# EAGLE design cat (EAGLE 9.3.1)
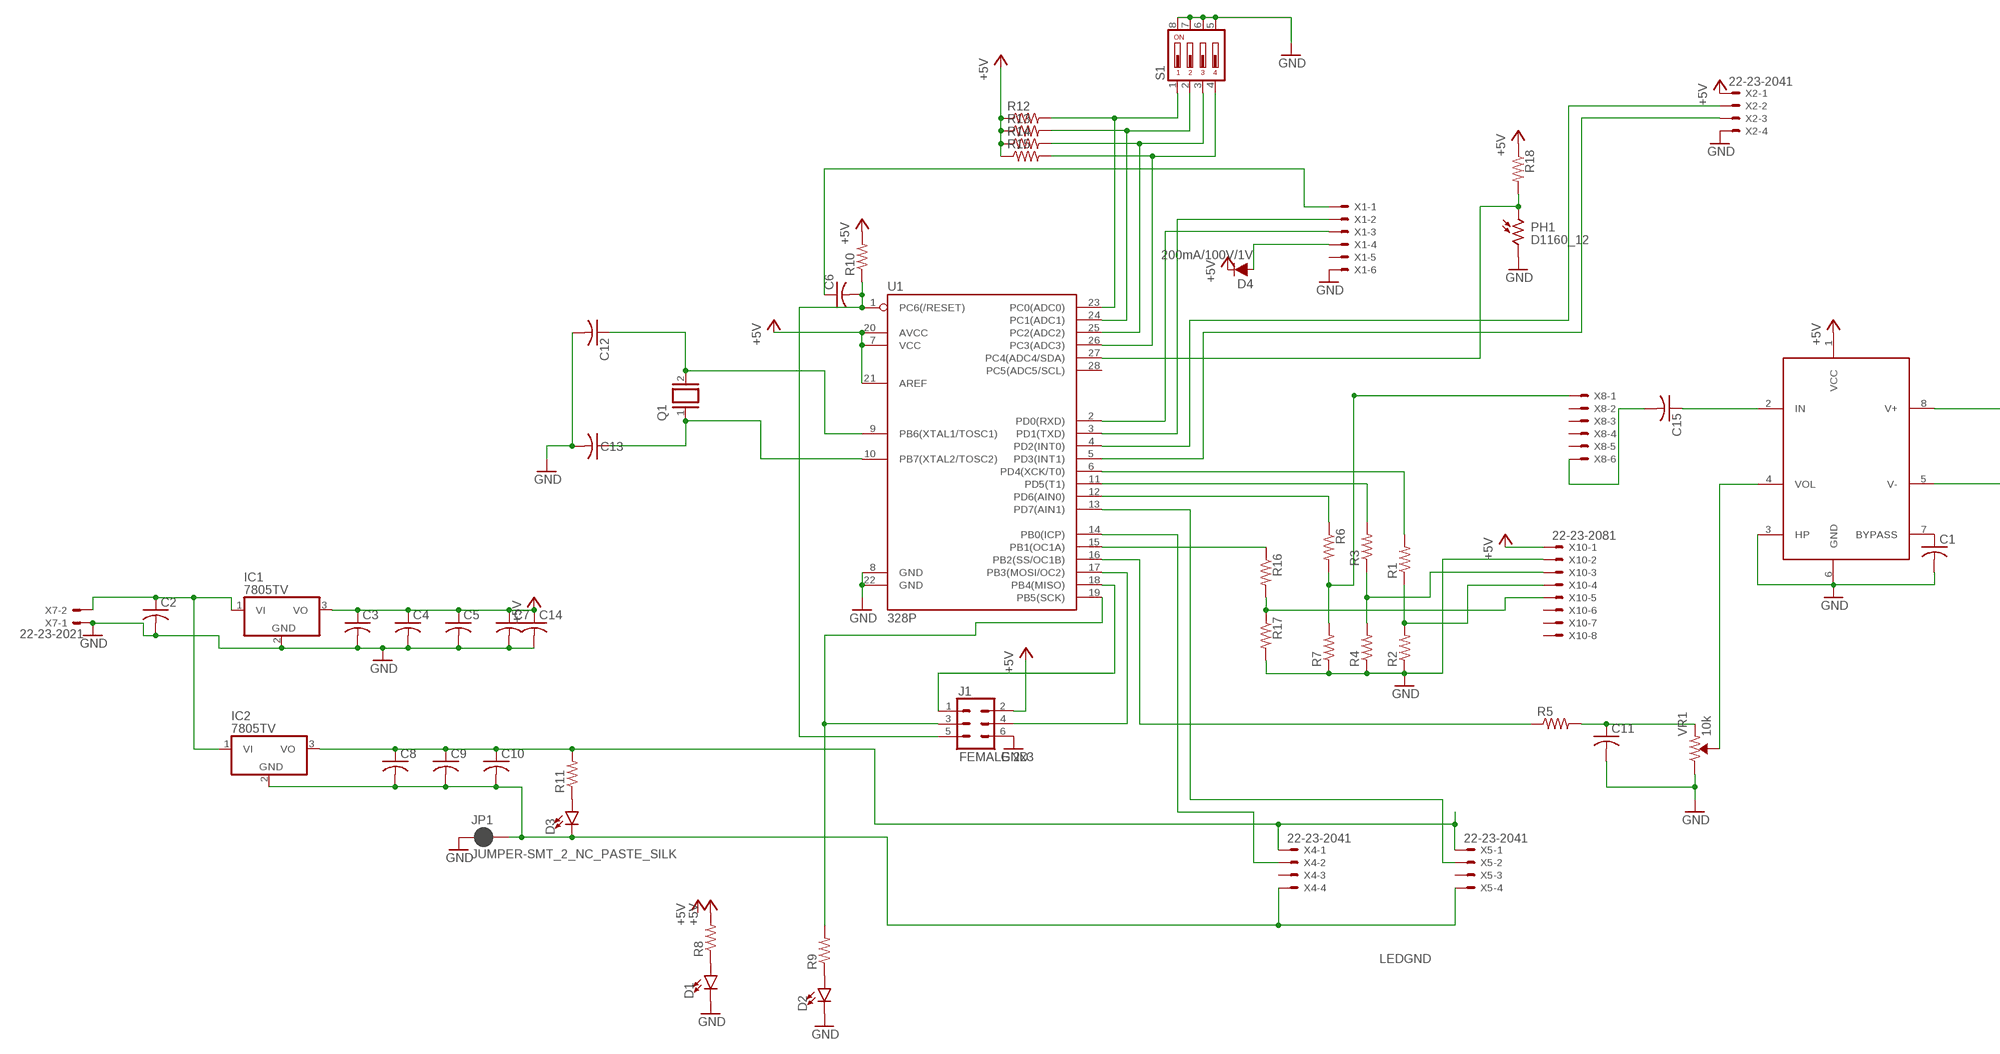
[diagram p0: schematic, sheet 1, part 1 of 2]
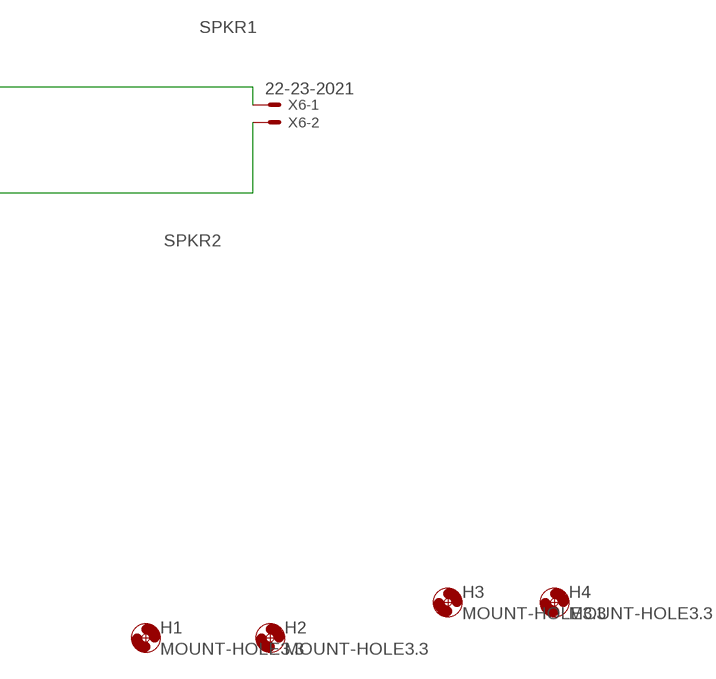
[diagram p1: schematic, sheet 1, part 2 of 2]

## Parts
C1  C-US025-024X044  [C025-024X044]
C2  C-US025-024X044  [C025-024X044]
C3  C-US025-024X044  [C025-024X044]
C4  C-US025-024X044  [C025-024X044]
C5  C-US025-024X044  [C025-024X044]
C6  C-US025-024X044  [C025-024X044]
C7  C-US025-024X044  [C025-024X044]
C8  C-US025-024X044  [C025-024X044]
C9  C-US025-024X044  [C025-024X044]
C10  C-US025-024X044  [C025-024X044]
C11  C-US025-024X044  [C025-024X044]
C12  C-US025-024X044  [C025-024X044]
C13  C-US025-024X044  [C025-024X044]
C14  C-US025-024X044  [C025-024X044]
C15  C-US025-024X044  [C025-024X044]
D1  LED-3MM-NO_SILK  [LED_3MM-NS]
D2  LED-3MM-NO_SILK  [LED_3MM-NS]
D3  LED-3MM-NO_SILK  [LED_3MM-NS]
D4  200mA/100V/1V  DIODE-1N4148  [DIODE-1N4148]
H1  MOUNT-HOLE3.3  [3,3]
H2  MOUNT-HOLE3.3  [3,3]
H3  MOUNT-HOLE3.3  [3,3]
H4  MOUNT-HOLE3.3  [3,3]
IC1  7805TV  [TO220V]
IC2  7805TV  [TO220V]
J1  FEMALE 2x3  CONN_03X2FEMALE  [2X3]
JP1  JUMPER-SMT_2_NC_PASTE_SILK  [SMT-JUMPER_2_NC_PASTE_SILK]
PH1  D1160_12  [D11XX]
Q1  XTAL/S  [QS]
R1  R-US_R0805  [R0805]
R2  R-US_R0805  [R0805]
R3  R-US_R0805  [R0805]
R4  R-US_R0805  [R0805]
R5  R-US_R0805  [R0805]
R6  R-US_R0805  [R0805]
R7  R-US_R0805  [R0805]
R8  R-US_R0805  [R0805]
R9  R-US_R0805  [R0805]
R10  R-US_R0805  [R0805]
R11  R-US_R0805  [R0805]
R12  R-US_R0805  [R0805]
R13  R-US_R0805  [R0805]
R14  R-US_R0805  [R0805]
R15  R-US_R0805  [R0805]
R16  R-US_R0805  [R0805]
R17  R-US_R0805  [R0805]
R18  R-US_R0805  [R0805]
S1  DIP04YL  [DIP04YL]
U1  328P  ATMEGA328P_PDIP  [DIP28]
U$1  LM4875  [SO8]
VR1  10k  TRIMPOT-PTH-10MM-KNOB-1/2W-10%  [TRIMPOT-PTH-3386U]
X1  22-23-2061  [22-23-2061]
X2  22-23-2041  [22-23-2041]
X4  22-23-2041  [22-23-2041]
X5  22-23-2041  [22-23-2041]
X6  22-23-2021  [22-23-2021]
X7  22-23-2021  [22-23-2021]
X8  22-23-2061  [22-23-2061]
X10  22-23-2081  [22-23-2081]

## Nets
+5V [pwr]: C3.1 C4.1 C5.1 C7.1 C14.1 D4.C IC1.3(VO) J1.2 R8.2 R10.2 R12.1 R13.1 R14.1 R15.1 R18.1 U1.7(VCC) U1.20(AVCC) U1.21(AREF) U$1.1(VCC) X2.1 X10.1
GND [pwr]: C1.2 C2.2 C3.2 C4.2 C5.2 C7.2 C11.2 C12.2 C13.2 C14.2 D1.K(C) D2.K(C) IC1.2(GND) J1.6 JP1.1 PH1.2 R2.1 R4.1 R7.1 R17.2 S1.5 S1.6 S1.7 S1.8 U1.8(GND) U1.22(GND) U$1.3(HP) U$1.6(GND) VR1.3(CW) X1.6 X2.4 X7.1 X10.2
INPWR [highpwr]: C2.1 IC1.1(VI) IC2.1(VI) X7.2
LEDGND [highpwr]: C8.2 C9.2 C10.2 D3.K(C) IC2.2(GND) JP1.2 X4.4 X5.4
LEDPWR [highpwr]: C8.1 C9.1 C10.1 IC2.3(VO) R11.2 X4.1 X5.1
N$1: R1.1 R2.2 X10.4
N$2: R1.2 U1.6(PD4(XCK/T0))
N$3: R3.2 U1.11(PD5(T1))
N$4: C15.2 X8.6
N$5: R3.1 R4.2 X10.3
N$6: R6.2 R7.2 X8.1
N$7: J1.3 R9.2 U1.19(PB5(SCK))
N$8: R6.1 U1.12(PD6(AIN0))
N$9: J1.1 U1.18(PB4(MISO))
N$10: J1.4 U1.17(PB3(MOSI/OC2))
N$11: R5.1 U1.16(PB2(SS/OC1B))
N$12: U1.13(PD7(AIN1)) X5.2
N$13: U$1.4(VOL) VR1.2(WIPER)
N$14: U1.14(PB0(ICP)) X4.2
N$15: R16.1 U1.15(PB1(OC1A))
N$16: C1.1 U$1.7(BYPASS)
N$17: C13.1 Q1.1 U1.10(PB7(XTAL2/TOSC2))
N$18: C11.1 R5.2 VR1.1(CCW)
N$19: R12.2 S1.1 U1.23(PC0(ADC0))
N$20: C6.2 J1.5 R10.1 U1.1(PC6(/RESET))
N$21: R13.2 S1.2 U1.24(PC1(ADC1))
N$22: C6.1 X1.1
N$23: U1.2(PD0(RXD)) X1.3
N$24: U1.3(PD1(TXD)) X1.2
N$25: D2.A R9.1
N$26: D1.A R8.1
N$27: R14.2 S1.3 U1.25(PC2(ADC2))
N$28: D3.A R11.1
N$29: R15.2 S1.4 U1.26(PC3(ADC3))
N$30: C12.1 Q1.2 U1.9(PB6(XTAL1/TOSC1))
N$31: U1.4(PD2(INT0)) X2.2
N$32: U1.5(PD3(INT1)) X2.3
N$33: D4.A X1.4
N$34: R16.2 R17.1 X10.5
N$35: C15.1 U$1.2(IN)
N$36: PH1.1 R18.2 U1.27(PC4(ADC4/SDA))
SPKR1 [pwr]: U$1.8(V+) X6.1
SPKR2 [pwr]: U$1.5(V-) X6.2
Unconnected: U1.28(PC5(ADC5/SCL)) X1.5 X4.3 X5.3 X8.2 X8.3 X8.4 X8.5 X10.6 X10.7 X10.8

## Library data of the parts
C1-C15 = rcl:C-US: CAPACITOR, American symbol; SPICEPREFIX: C
D1-D3 = SparkFun-LED:LED: LED (Generic) Standard schematic elements and footprints for 5mm, 3mm, 1206, and 0603 sized LEDs. Generic LEDs with no color specified.
D4 = SparkFun-DiscreteSemi:DIODE: Diode These are standard reverse protection diodes and small signal diodes. SparkFun Products: SparkFun SparkPunk Sound Kit <https://www.sparkfun.com/products/11177> SparkFun ESP8266 Thing <https://www.sparkfun.com/products/13231>; PROD_ID: DIO-08378
H1-H4 = holes:MOUNT-HOLE: MOUNTING HOLE with drill center marker
IC1 IC2 = linear:78*: Positive VOLTAGE REGULATOR Source: http://cache.national.com/ds/LM/LM78L05.pdf http://www.fairchildsemi.com/ds/LM/LM7805.pdf
J1 = SparkFun-Connectors:CONN_03X2: Multi connection point. Often used as Generic Header-pin footprint for 0.1 inch spaced/style header connections You can populate with any combo of single row headers, but if you'd like an exact match, check these: Header - 2x3 (Male, 0.1") <https://www.sparkfun.com/products/12807> (PRT-12807) Header - 2x3 (Female, 0.1") <https://www.sparkfun.com/products/13010> (PRT-13010) 2x3 Pin Shrouded Header <https://www.sparkfun.com/products/10877> (PRT-10877) On any of the 0.1 inch spaced packages, you can populate with these: Break Away Headers - Straight <https://www.sparkfun.com/products/116> (PRT-00116) Break Away Male Headers - Right Angle <https://www.sparkfun.com/products/553> (PRT-00553) Female Headers <https://www.sparkfun.com/products/115> (PRT-00115) Break Away Headers - Machine Pin <https://www.sparkfun.com/products/117> (PRT-00117) Break Away Female Headers - Swiss Machine Pin <https://www.sparkfun.com/products/743> (PRT-00743) Special note: the shrouded connector mates well with our 3x2 ribbon cables: Ribbon Crimp Connector - 6-pin (2x3, Female) <https://www.sparkfun.com/products/10651> (PRT-10651) Ribbon Cable - 6 wire (15ft) <https://www.sparkfun.com/products/10646> (PRT-10646); PROD_ID: CONN-11566
JP1 = SparkFun-Jumpers:JUMPER-SMT_2_NC_PASTE: Normally closed solder jumper This jumper has an aperture in the stencil to allow solder paste to bridge the split in the wire so it's normally closed (NC). Wick off the solder to open the connection. Reapply solder to reclose the connection.
PH1 = photo-elements:D11: Photo Sensor Oil Burner Control Applications Source: http://optoelectronics.perkinelmer.com/content/Datasheets/DTS_PhotocellsD1160.pdf
Q1 = special:XTAL/S: CRYSTAL
R1-R18 = rcl:R-US_: RESISTOR, American symbol; SPICEPREFIX: R
S1 = switch-dil:DIP04YL: DIL/CODE SWITCH; OC_FARNELL: unknown; OC_NEWARK: unknown
U1 = SparkFun-IC-Microcontroller:ATMEGA328P_PDIP: Atmel 328P Through hole ATMEGA328P uC used in the Arduino 32kb flash, 1k EEPROM, 2k SRAM Datasheet <http://www.sparkfun.com/datasheets/Components/SMD/ATMega328.pdf> SparkFun Products Storefront component: AVR 28 Pin 20MHz 32K 6A/D - ATMega328P <https://www.sparkfun.com/products/9061> (COM-09061) SparkFun Simon Says - Through-Hole Soldering Kit <https://www.sparkfun.com/products/10547> (KIT-10547) SparkFun Learn to Solder - Simon Says <https://www.sparkfun.com/products/13708> (KIT-13708) SparkFun BigTime Watch Kit <https://www.sparkfun.com/products/11734> (KIT-11734) SparkFun ClockIt <https://www.sparkfun.com/products/10930> (KIT-10930) SparkFun Serial Enabled LCD Kit <https://www.sparkfun.com/products/10097> (LCD-10097) SparkFun Simon Tilts - Through Hole Soldering Kit <https://www.sparkfun.com/products/12634> (KIT-12634) SparkFun Frequency Counter Kit <https://www.sparkfun.com/products/10140> (KIT-10140) FabFM Radio Kit <https://www.sparkfun.com/products/11043> (KIT-11043) SparkFun Binary Blaster Kit <https://www.sparkfun.com/products/12037> (KIT-12037) SparkFun Metro-Gnome <https://www.sparkfun.com/products/9236> (KIT-09236) ATmega328 with Arduino Optiboot (Uno) <https://www.sparkfun.com/products/10524> (DEV-10524); PROD_ID: IC-09136
U$1 = myc1:LM4875
VR1 = SparkFun-Resistors:TRIMPOT: Trimming Potentiometer (Trimpot) Three-terminal potentiometers, with an adjustable wiper and two adjustable resistors. A pot can be used to create a configurable voltage divider, or as a variable resistor. "Trimpots" are a subset of potentiometers, usually intended for "set-and-forget" applications. They're often more delicate than standard potentiometers - rated for fewer turns. Variants PTH-KNOB - PTH Trimpot w/ finger-adjustable knob Trimpot 10K with Knob <https://www.sparkfun.com/products/9806> (COM-09806) Datasheet <http://www.sparkfun.com/datasheets/Components/General/TSR-3386.pdf> SMD-3MM-CLOSED-FRAME - SMD 3mm Square Closed-Frame Trimpot Used on e.g. EasyDriver - Stepper Motor Driver <https://www.sparkfun.com/products/12779> Datasheet <http://www.bitechnologies.com/pdfs/22.pdf> (22AR10KTR) SMD-5MM - SMD 5mm Square Closed-Frame Trimpot Used on e.g. IOIO-OTG - V2.2 <https://www.sparkfun.com/products/13613> Datasheet <http://www.vishay.com/docs/51008/ts53.pdf> (TS53YL502MR10) SMD-3MM-1/10W-25% - 3mm Square Open-Frame Trimpot Used on e.g. SparkFun Shapeoko <https://www.sparkfun.com/products/13899> Datasheet <http://www.bourns.com/docs/Product-Datasheets/TC33.pdf> (TC33X-2-103E); PROD_ID: RES-09730; SF_SKU: COM-09806
X1 X8 = con-molex:22-23-2061: .100" (2.54mm) Center Header - 6 Pin; MF: MOLEX; MPN: 22-23-2061; OC_FARNELL: 1462922; OC_NEWARK: 27C1933
X2 X4 X5 = con-molex:22-23-2041: .100" (2.54mm) Center Header - 4 Pin; MF: MOLEX; MPN: 22-23-2041; OC_FARNELL: 1462920; OC_NEWARK: 38C0355
X6 X7 = con-molex:22-23-2021: .100" (2.54mm) Center Header - 2 Pin; MF: MOLEX; MPN: 22-23-2021; OC_FARNELL: 1462926; OC_NEWARK: 25C3832
X10 = con-molex:22-23-2081: .100" (2.54mm) Center Header - 8 Pin; MF: MOLEX; MPN: 22-23-2081; OC_FARNELL: 1756826; OC_NEWARK: 01C7592

## Net classes
1 pwr: width 0.381 mm
2 highpwr: width 0.635 mm

## Board
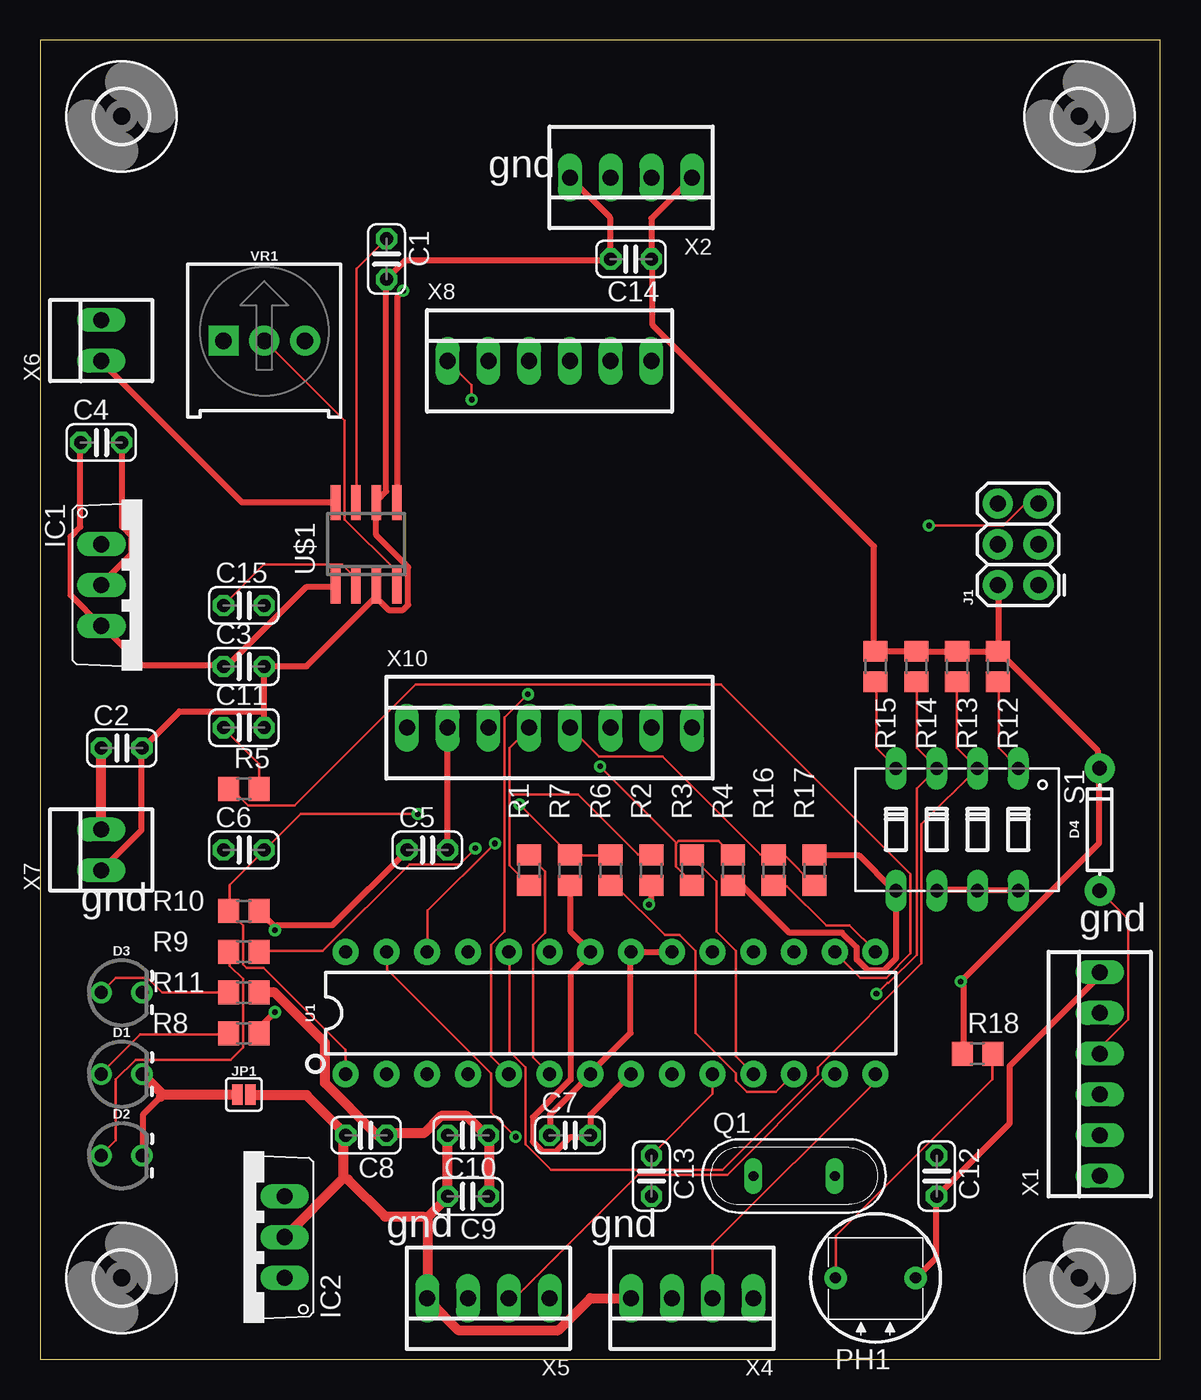
[diagram p2: board, top side]
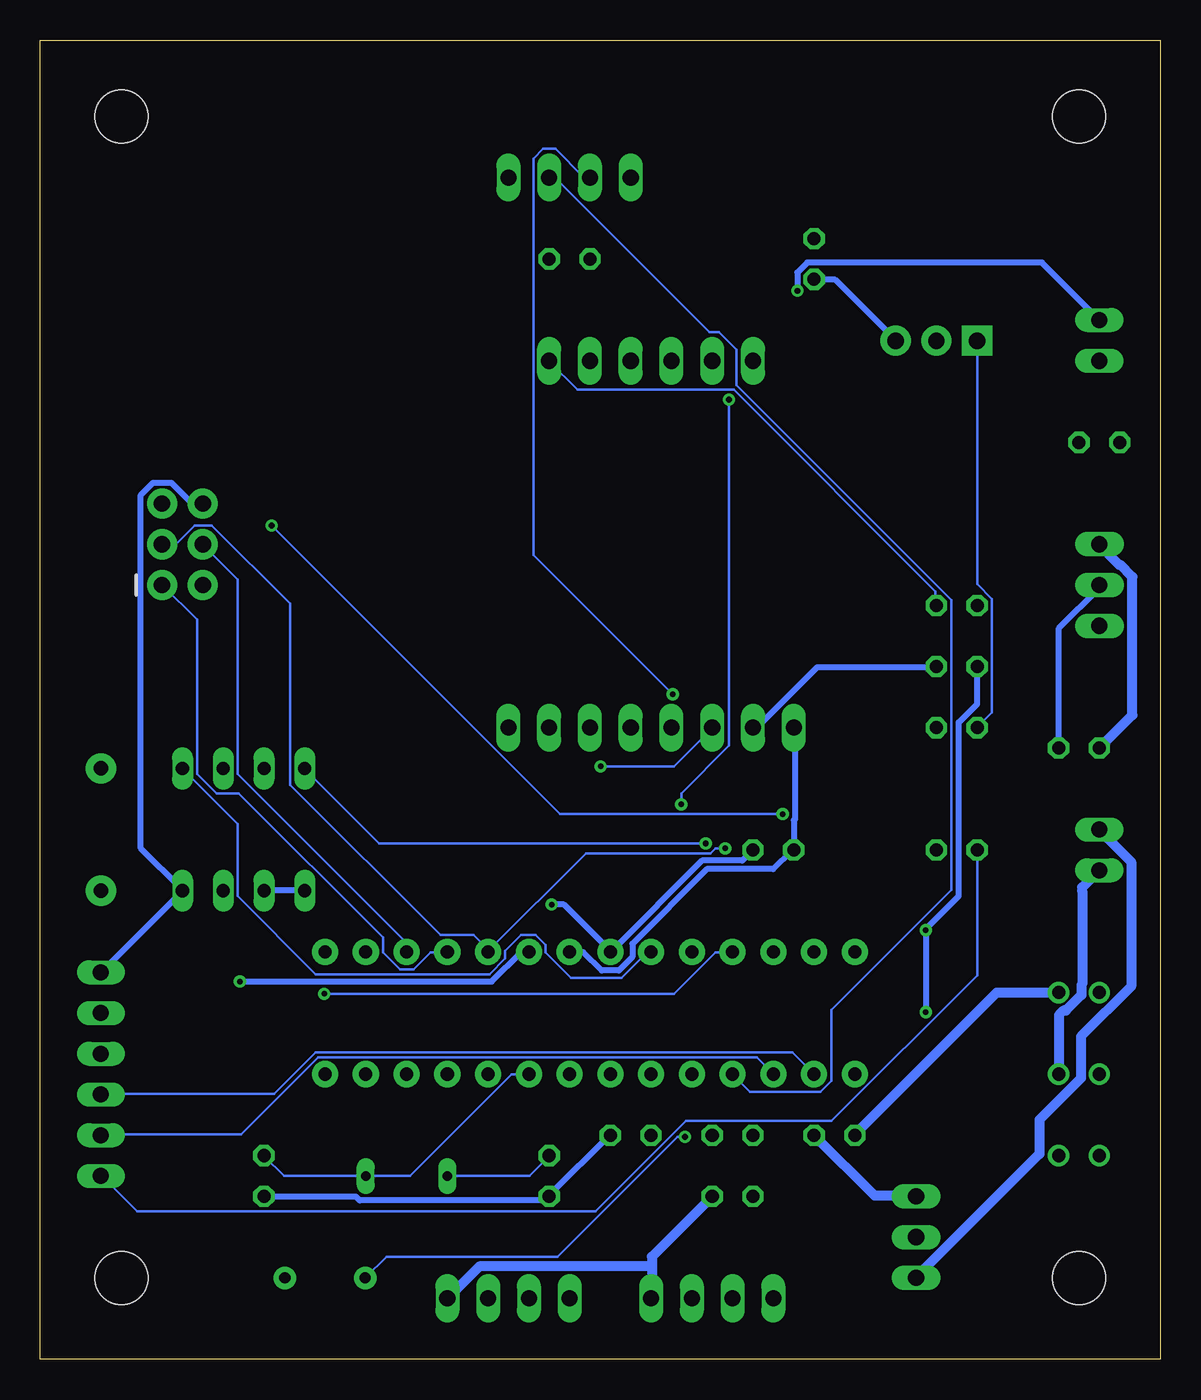
[diagram p3: board, bottom side, seen from below]

Size 69.83 x 82.22 mm. Coordinates in mm from the lower left corner, seen from the top.
Outline: 0,0 69.83,0 69.83,82.22 0,82.22 0,0
Copper layers (1*16): Top 0.035mm / dielectric 1.5mm / Bottom 0.035mm
Design rules "default": minimum track width 6mil, minimum drill 0.35mm, track to track 6mil, track to pad 6mil, pad to pad 6mil, via to via 6mil, smd to smd 6mil, copper to edge 40mil, drill to drill 6mil, minimum pad ring 10mil, minimum via ring 8mil, stop-mask expansion 4mil, vias tented up to drill 0mil, thermal gap 10mil

### Footprints (pad centres in the part's own frame; a part is rotated, then mirrored left to right if it is on the bottom)
C025-024X044 = drill 0.813 octagon: 1 -1.27,0; 2 1.27,0
LED_3MM-NS = drill 0.813: A -1.27,0; K 1.27,0
DIODE-1N4148 = drill 0.9 pad 1.88: A -3.81,0; C 3.81,0
3,3 = hole 3.3: 0,0
TO220V = drill 1.016 long: 1 -2.54,-2.54; 2 0,-2.54; 3 2.54,-2.54
2X3 = drill 1.016 pad 1.88: 1 0,0; 2 0,2.54; 3 2.54,0; 4 2.54,2.54; 5 5.08,0; 6 5.08,2.54
SMT-JUMPER_2_NC_PASTE_SILK = smd 0.635 x 1.27: 1 -0.406,0; 2 0.406,0
D11XX = drill 0.7 pad 1.4: 1 -2.5,0; 2 2.5,0
QS = drill 0.61 long: 1 -2.54,0; 2 2.54,0
R0805 = smd 1.3 x 1.5: 1 -0.95,0; 2 0.95,0
DIP04YL = drill 0.813 long: 1 -3.81,-3.81; 2 -1.27,-3.81; 3 1.27,-3.81; 4 3.81,-3.81; 5 3.81,3.81; 6 1.27,3.81; 7 -1.27,3.81; 8 -3.81,3.81
DIP28 = drill 0.813 pad 1.626: 1 -16.51,-3.81; 2 -13.97,-3.81; 3 -11.43,-3.81; 4 -8.89,-3.81; 5 -6.35,-3.81; 6 -3.81,-3.81; 7 -1.27,-3.81; 8 1.27,-3.81; 9 3.81,-3.81; 10 6.35,-3.81; 11 8.89,-3.81; 12 11.43,-3.81; 13 13.97,-3.81; 14 16.51,-3.81; 15 16.51,3.81; 16 13.97,3.81; 17 11.43,3.81; 18 8.89,3.81; 19 6.35,3.81; 20 3.81,3.81; 21 1.27,3.81; 22 -1.27,3.81; 23 -3.81,3.81; 24 -6.35,3.81; 25 -8.89,3.81; 26 -11.43,3.81; 27 -13.97,3.81; 28 -16.51,3.81
SO8 = smd 0.6 x 2.2: 1 -1.905,-2.6; 2 -0.635,-2.6; 3 0.635,-2.6; 4 1.905,-2.6; 5 1.905,2.6; 6 0.635,2.6; 7 -0.635,2.6; 8 -1.905,2.6
TRIMPOT-PTH-3386U = drill 1.016 pad 1.88 square: 1 -2.54,-0.015 | drill 1.016 pad 1.88: 2 0,-0.015; 3 2.54,-0.015
22-23-2061 = drill 1 long: 1 -6.35,0; 2 -3.81,0; 3 -1.27,0; 4 1.27,0; 5 3.81,0; 6 6.35,0
22-23-2041 = drill 1 long: 1 -3.81,0; 2 -1.27,0; 3 1.27,0; 4 3.81,0
22-23-2021 = drill 1 long: 1 -1.27,0; 2 1.27,0
22-23-2081 = drill 1 long: 1 -8.89,0; 2 -6.35,0; 3 -3.81,0; 4 -1.27,0; 5 1.27,0; 6 3.81,0; 7 6.35,0; 8 8.89,0

### Placement (x,y rotation side)
C1  21.59,68.58 270 top
C2  5.08,38.1 0 top
C3  12.7,43.18 0 top
C4  3.81,57.15 0 top
C5  24.13,31.75 0 top
C6  12.7,31.75 0 top
C7  33.02,13.97 0 top
C8  20.32,13.97 180 top
C9  26.67,10.16 180 top
C10  26.67,13.97 180 top
C11  12.7,39.37 0 top
C12  55.88,11.43 270 top
C13  38.1,11.43 270 top
C14  36.83,68.58 180 top
C15  12.7,46.99 0 top
D1  5.08,17.78 0 top
D2  5.08,12.7 0 top
D3  5.08,22.86 0 top
D4  66.04,33.02 90 top
H1  5.08,5.08 0 top
H2  64.77,5.08 0 top
H3  64.77,77.47 0 top
H4  5.08,77.47 0 top
IC1  6.35,48.26 270 top
IC2  12.7,7.62 90 top
J1  62.23,48.26 90 top
JP1  12.7,16.51 0 top
PH1  52.07,5.08 0 top
Q1  46.99,11.43 0 top
R1  30.48,30.48 90 top
R2  38.1,30.48 90 top
R3  40.64,30.48 90 top
R4  43.18,30.48 90 top
R5  12.7,35.56 0 top
R6  35.56,30.48 90 top
R7  33.02,30.48 90 top
R8  12.7,20.32 0 top
R9  12.7,25.4 0 top
R10  12.7,27.94 0 top
R11  12.7,22.86 0 top
R12  59.69,43.18 270 top
R13  57.15,43.18 270 top
R14  54.61,43.18 270 top
R15  52.07,43.18 270 top
R16  45.72,30.48 90 top
R17  48.26,30.48 90 top
R18  58.42,19.05 0 top
S1  57.15,33.02 180 top
U1  35.56,21.59 0 top
U$1  20.32,50.8 0 top
VR1  13.97,63.5 0 top
X1  66.04,17.78 90 top
X2  36.83,73.66 180 top
X4  40.64,3.81 180 top
X5  27.94,3.81 180 top
X6  3.81,63.5 90 top
X7  3.81,31.75 90 top
X8  31.75,62.23 0 top
X10  31.75,39.37 0 top

### Tracks (layer width: path | path; a pad name or v marks a point on that pad's centre or on a via)
+5V  (via drill 0.35)
  Top 0.381: U$1.1 18.36,48.16 16.61,48.16 11.66,43.2 11.43,43.2 C3.1 11.28,43.28 6.33,43.28 3.96,45.64 IC1.3 1.91,47.62 1.91,51.28 2.52,51.89 2.52,57.15 C4.1 | U1.20 39.32,25.38 36.88,25.38 U1.21 36.8,25.22 36.8,20.34 34.37,17.91 U1.7 34.29,17.75 31.77,15.24 31.77,14.02 C7.1 | v14.63,21.64 13.72,20.73 13.72,20.34 R8.2 | R10.2 13.72,27.89 14.63,26.98 v14.63,26.75 14.78,27.05 18.21,27.05 22.86,31.7 C5.1 | 57.53,23.55 57.53,23.7 65.99,32.16 65.99,36.8 D4.C 65.91,36.96 65.91,37.95 59.82,44.04 R12.1 | 57.53,23.55 57.53,19.05 R18.1 | X2.1 40.62,73.61 38.1,71.09 C14.1 38.18,68.43 38.18,64.47 51.97,50.67 51.97,44.27 R15.1 52.12,44.12 54.56,44.12 R14.1 54.79,44.12 R13.1 57.3,44.12 59.66,44.12 R12.1 | J1.2 59.74,48.23 59.74,44.27 R12.1 | v57.38,23.55 57.53,23.55
  Bottom 0.381: v14.63,21.64 v14.63,26.75 14.55,26.9 12.57,28.88 12.57,39.7 11.43,40.84 C3.1 | X10.1 22.86,39.32 22.78,39.24 22.78,33.68 22.86,33.6 C5.1 23.01,31.7 24.16,30.56 28.27,30.56 32.92,25.91 32.92,25.07 33.76,24.23 34.82,24.23 35.97,25.38 36.8,25.38 U1.21 | v57.38,23.55 41.68,23.55 39.85,25.38 39.4,25.38 U1.20
GND  (via drill 0.35)
  Top 0.381: R4.1 43.2,29.49 43.81,29.49 46.71,26.59 49.99,26.59 50.9,25.68 50.9,24.92 51.59,24.23 52.58,24.23 53.34,24.99 S1.5 53.19,29.26 51.05,31.39 48.31,31.39 R17.2 | S1.6 55.93,29.26 58.37,29.26 S1.7 58.6,29.26 60.96,29.26 S1.8 | PH1.2 54.63,5.11 55.85,6.33 55.85,10.13 C12.2 60.43,14.71 60.43,18.29 65.99,23.85 65.99,24.08 X1.6 | U1.8 34.29,15.24 C7.2 34.14,13.87 33.07,13.87 32.16,12.95 31.32,12.95 30.71,13.56 30.71,15.09 33.07,17.45 33.07,24.08 34.21,25.22 U1.22 34.29,25.45 33.07,26.67 33.07,29.49 R7.1 | X2.4 35.51,71.17 35.51,68.58 C14.2 35.36,68.5 22.78,68.5 C1.2 21.57,67.13 21.57,54.1 21.03,53.57 U$1.6 20.95,51.36 22.94,49.38 22.94,47.02 22.63,46.71 21.72,46.71 21.03,47.4 U$1.3 20.95,47.55 16.61,43.2 14.02,43.2 C3.2 13.95,43.05 13.95,40.39 | R2.1 38.1,28.5 v37.95,28.35 | C5.2 25.38,31.77 25.38,39.32 X10.2 | 13.95,40.39 13.95,39.4 C11.2 | C4.2 5.11,57.15 5.11,51.89 5.71,51.28 5.71,50.22 3.81,48.31 IC1.2 | JP1.1 12.27,16.54 7.62,16.54 7.54,16.38 6.4,15.24 6.4,12.72 D2.K | X7.1 6.33,32.99 6.33,38.1 C2.2 6.48,38.18 8.69,40.39 13.95,40.39
  Top 0.61: D1.K 7.59,16.54 7.62,16.54 | 7.54,16.38 7.67,16.51 JP1.1
  Bottom 0.381: X1.6 65.99,24.16 60.96,29.18 S1.8 61.04,29.34 63.55,31.85 63.55,53.87 62.79,54.63 61.65,54.63 60.35,53.34 J1.6 | S1.5 53.34,29.26 55.85,29.26 S1.6 | C7.2 34.29,14.02 38.1,10.21 C13.2 38.25,10.06 38.41,9.91 49.91,9.91 50.14,10.13 55.85,10.13 C12.2 | C1.2 21.57,67.28 20.27,67.28 16.54,63.55 VR1.3 | v37.95,28.35 37.19,28.35 34.29,25.45 U1.22 34.14,25.53 28.57,31.09 26.06,31.09 C5.2 | 4.88,22.86 6.33,21.41 | 4.88,29.41 4.88,29.21 | 6.33,17.83 D1.K | IC1.2 3.81,48.08 6.33,45.57 6.33,38.1 C2.2 | X10.2 25.38,39.4 25.15,39.4 21.41,43.13 14.02,43.13 C3.2
  Bottom 0.61: X7.1 4.88,29.41 | 4.88,29.21 4.88,23.37 4.93,23.32 4.93,22.7 5.89,21.74 6.04,21.74 6.33,21.46 6.33,21.41 6.33,17.83
INPWR
  Top 0.635: X7.2 C2.1
  Bottom 0.635: C2.1 1.75,40.16 1.75,48.77 2.52,49.53 2.59,49.53 3.81,50.75 IC1.1 | IC2.1 15.24,5.11 7.54,12.8 7.54,14.94 4.95,17.53 4.95,20.12 1.83,23.24 1.83,31.01 3.81,32.99 X7.2
LEDGND
  Top 0.635: C10.2 25.38,13.95 25.38,10.21 C9.2 25.22,9.91 24.16,8.84 | 24.16,8.84 24.16,3.81 X5.4 24.31,3.58 26.06,1.83 32.31,1.83 34.29,3.81 X4.4 | JP1.2 13.11,16.46 16.61,16.46 19.05,14.02 C8.2 18.9,13.72 18.9,11.28 | 18.9,11.28 IC2.2 | 24.16,8.84 23.85,8.91 21.49,8.91 19.2,11.2 18.9,11.28
  Bottom 0.635: D3.K 10.21,22.86 19.05,14.02 C8.2
LEDPWR
  Top 0.635: R11.2 14.63,22.86 17.75,19.74 17.75,17.22 20.95,14.02 21.57,14.02 C8.1 21.87,14.1 23.93,14.1 24.99,15.16 26.59,15.16 27.66,14.1 C10.1 27.96,13.95 27.96,10.21 C9.1
  Bottom 0.635: C8.1 17.83,10.21 15.24,10.21 IC2.3 | 31.7,5.79 31.7,6.4 C9.1 | 31.7,5.79 31.7,3.81 X5.1 | 31.7,5.79 42.44,5.79 44.42,3.81 X4.1
N$1
  Top 0.152: 29.26,35.2 29.26,38.1 30.48,39.32 X10.4 | 29.26,35.2 29.26,30.79 30.48,29.57 R1.1 | 29.26,35.2 33.53,35.2 37.26,31.47 38.1,31.47 R2.2
N$2
  Top 0.152: U1.6 30.71,18.82 30.71,25.83 31.47,26.59 31.47,30.4 30.48,31.39 R1.2
N$3
  Top 0.152: R3.2 40.69,31.39 40.69,31.24 42.14,29.79 42.14,26.67 43.36,25.45 43.36,18.9 44.42,17.83 U1.11
N$4
  Bottom 0.152: C15.2 14.02,47.02 14.02,47.85 26.59,60.43 36.35,60.43 38.1,62.18 X8.6
N$5  (via drill 0.35)
  Top 0.152: 39.66,32.19 39.78,32.31 42.29,32.31 43.13,31.47 R4.2 | 39.66,32.19 39.62,32.16 39.62,30.71 40.62,29.72 40.62,29.57 R3.1 | v34.9,36.96 39.66,32.19
  Bottom 0.152: v34.9,36.96 30.33,36.96 27.96,39.32 X10.3
N$6  (via drill 0.35)
  Top 0.152: R6.2 35.51,31.39 33.07,31.39 R7.2 32.99,31.47 v29.87,34.59 | v26.9,59.82 26.9,60.73 X8.1
  Bottom 0.152: v29.87,34.59 29.87,35.28 26.9,38.25 v26.9,59.82
N$7  (via drill 0.35)
  Top 0.152: v27.13,31.85 26.14,30.86 23.01,30.86 17.6,25.45 13.72,25.45 R9.2
  Bottom 0.152: v27.13,31.85 27.74,31.85 28.04,31.55 35.81,31.55 41.91,25.45 U1.19 41.91,25.53 42.82,26.44 44.88,26.44 54.25,35.81 54.25,47.09 59.13,51.97 60.2,51.97 61.34,50.83 62.18,50.83 J1.3
N$8
  Top 0.152: R6.1 35.59,29.49 35.89,29.49 38.94,26.44 39.85,26.44 40.84,25.45 40.84,20.34 43.36,17.83 43.36,17.37 44.04,16.69 45.87,16.69 46.94,17.75 U1.12
N$9
  Bottom 0.152: U1.18 44.5,25.38 45.49,25.38 46.56,24.31 47.4,24.31 48.46,25.38 48.46,26.29 57.45,35.28 58.83,35.28 60.05,36.5 60.05,46.1 62.18,48.23 J1.1
N$10
  Bottom 0.152: U1.17 47.02,25.45 47.02,25.98 57.53,36.5 57.53,48.62 59.66,50.75 J1.4
N$11
  Top 0.152: R5.1 11.81,35.51 11.96,35.51 12.95,34.52 15.85,34.52 23.39,42.06 42.44,42.06 54.25,30.25 54.25,25.3 52.73,23.77 51.13,23.77 49.53,25.38 U1.16
N$12
  Top 0.152: X5.2 29.57,3.81 37.26,11.51 42.82,11.51 49.07,17.75 49.53,17.75 U1.13
N$13
  Top 0.152: U$1.4 22.17,48.23 22.17,49.15 18.97,52.35 18.97,58.52 14.02,63.48 VR1.2
N$14
  Top 0.152: X4.2 41.91,7.16 52.05,17.3 52.05,17.75 U1.14
N$15
  Top 0.152: R16.1 45.72,29.49 46.56,29.49 49,27.05 50.44,27.05 52.05,25.45 U1.15
N$16
  Top 0.152: U$1.7 19.74,53.42 19.74,67.97 21.57,69.8 C1.1
N$17
  Top 0.152: U1.10 41.91,16.54 38.1,12.72 C13.1
  Bottom 0.152: Q1.1 39.32,11.43 38.1,12.65 C13.1
N$18
  Top 0.152: R5.2 13.64,35.59 13.64,37.11 11.43,39.32 C11.1
  Bottom 0.152: VR1.1 11.43,48.31 10.52,47.4 10.52,40.31 11.43,39.4 C11.1
N$19
  Top 0.152: R12.2 59.74,42.22 59.74,38.1 60.96,36.88 S1.1
  Bottom 0.152: U1.23 31.77,25.38 32,25.38 33.6,23.77 36.73,23.77 38.33,25.38 38.33,25.83 38.94,26.44 39.85,26.44 40.84,25.45 40.84,24.99 41.83,24 52.65,24 57.53,28.88 57.53,33.38 60.96,36.8 S1.1
N$20  (via drill 0.35)
  Top 0.152: U1.1 19.05,19.28 13.95,24.38 12.88,24.38 12.65,24.61 12.65,27.05 11.81,27.89 R10.1 11.81,27.96 11.81,29.57 13.95,31.7 C6.2 14.02,31.77 16.23,33.98 v23.55,33.98 | J1.5 61.42,53.34 60.05,51.97 v55.4,51.97
  Bottom 0.152: v55.4,51.97 37.41,33.98 v23.55,33.98
N$21
  Top 0.152: R13.2 57.15,38.1 S1.2 58.37,36.8 54.94,33.38 54.94,24.69 48.46,18.21 48.46,17.75 42.52,11.81 31.85,11.81 30.25,13.41 30.25,18.21 29.26,19.2 29.26,25.38 U1.24
N$22
  Bottom 0.152: C6.1 11.43,23.93 20.5,14.86 29.57,14.86 35.2,9.22 63.78,9.22 65.99,11.43 X1.1
N$23
  Bottom 0.152: U1.2 22.94,19.13 52.65,19.13 55.24,16.54 65.99,16.54 X1.3
N$24
  Bottom 0.152: X1.2 65.99,14.02 57.3,14.02 52.5,18.82 25.15,18.82 24.16,17.83 U1.3
N$25
  Top 0.152: R9.1 11.81,25.38 11.81,24.54 12.65,23.7 12.65,19.43 11.89,18.67 5.94,18.67 4.72,17.45 4.72,13.64 3.81,12.72 D2.A
N$26
  Top 0.152: R8.1 11.73,20.27 6.25,20.27 3.81,17.83 D1.A
N$27  (via drill 0.35)
  Top 0.152: R14.2 54.63,42.22 54.63,38.1 55.85,36.88 S1.3 54.63,35.59 54.63,25.22 52.88,23.47 52.81,23.47 v52.12,22.78
  Bottom 0.152: v52.12,22.78 30.33,22.78 27.74,25.38 26.67,25.38 U1.25
N$28
  Top 0.152: R11.1 7.62,22.86 6.71,23.77 4.72,23.77 D3.A
N$29  (via drill 0.35)
  Top 0.152: R15.2 52.12,42.22 52.12,38.1 53.34,36.88 S1.4 | v28.35,32.16 24.16,27.96 24.16,25.45 U1.26
  Bottom 0.152: v28.35,32.16 48.69,32.16 53.34,36.8 S1.4
N$30
  Bottom 0.152: C12.1 55.85,12.65 54.63,11.43 Q1.2 46.79,11.43 40.46,17.75 39.4,17.75 U1.9
N$31
  Bottom 0.152: X2.2 38.1,73.61 37.72,73.61 28.12,64.01 27.51,64.01 26.44,62.94 26.44,60.73 13.03,47.32 13.03,29.26 20.5,21.79 20.5,17.37 21.18,16.69 25.6,16.69 26.67,17.75 U1.4
N$32  (via drill 0.35)
  Top 0.152: v30.4,41.45 28.96,40.01 28.96,26.67 28.12,25.83 28.12,18.9 29.18,17.83 U1.5
  Bottom 0.152: v30.4,41.45 39.09,50.14 39.09,74.83 38.48,75.44 37.72,75.44 35.97,73.69 35.59,73.69 X2.3
N$33
  Top 0.152: D4.A 67.82,27.43 67.82,21.18 66.06,19.43 66.06,19.05 X1.4
N$34
  Top 0.152: R17.1 48.23,29.57 46.41,31.39 45.72,31.39 R16.2 45.72,31.47 44.88,31.47 38.79,37.57 34.82,37.57 X10.5
N$35
  Top 0.152: U$1.2 19.66,48.23 19.66,48.69 18.82,49.53 13.95,49.53 11.43,47.02 C15.1
N$36  (via drill 0.35)
  Top 0.152: R18.2 59.36,17.45 49.61,7.7 49.61,5.11 PH1.1 | v29.64,13.87 28.12,15.39 28.12,17.83 21.64,24.31 21.64,25.38 U1.27
  Bottom 0.152: v29.64,13.87 30.1,13.87 37.57,6.4 48.23,6.4 49.53,5.11 PH1.1
SPKR1
  Top 0.381: U$1.8 18.36,53.42 12.57,53.42 3.81,62.18 X6.1
SPKR2  (via drill 0.35)
  Top 0.381: v22.63,66.6 22.25,66.22 22.25,53.42 U$1.5
  Bottom 0.381: v22.63,66.6 22.63,67.74 22.02,68.35 7.39,68.35 X6.2

### Text on the board
tNames: gnd | gnd | gnd | gnd | gnd